# EAGLE design shield (EAGLE 6.4)
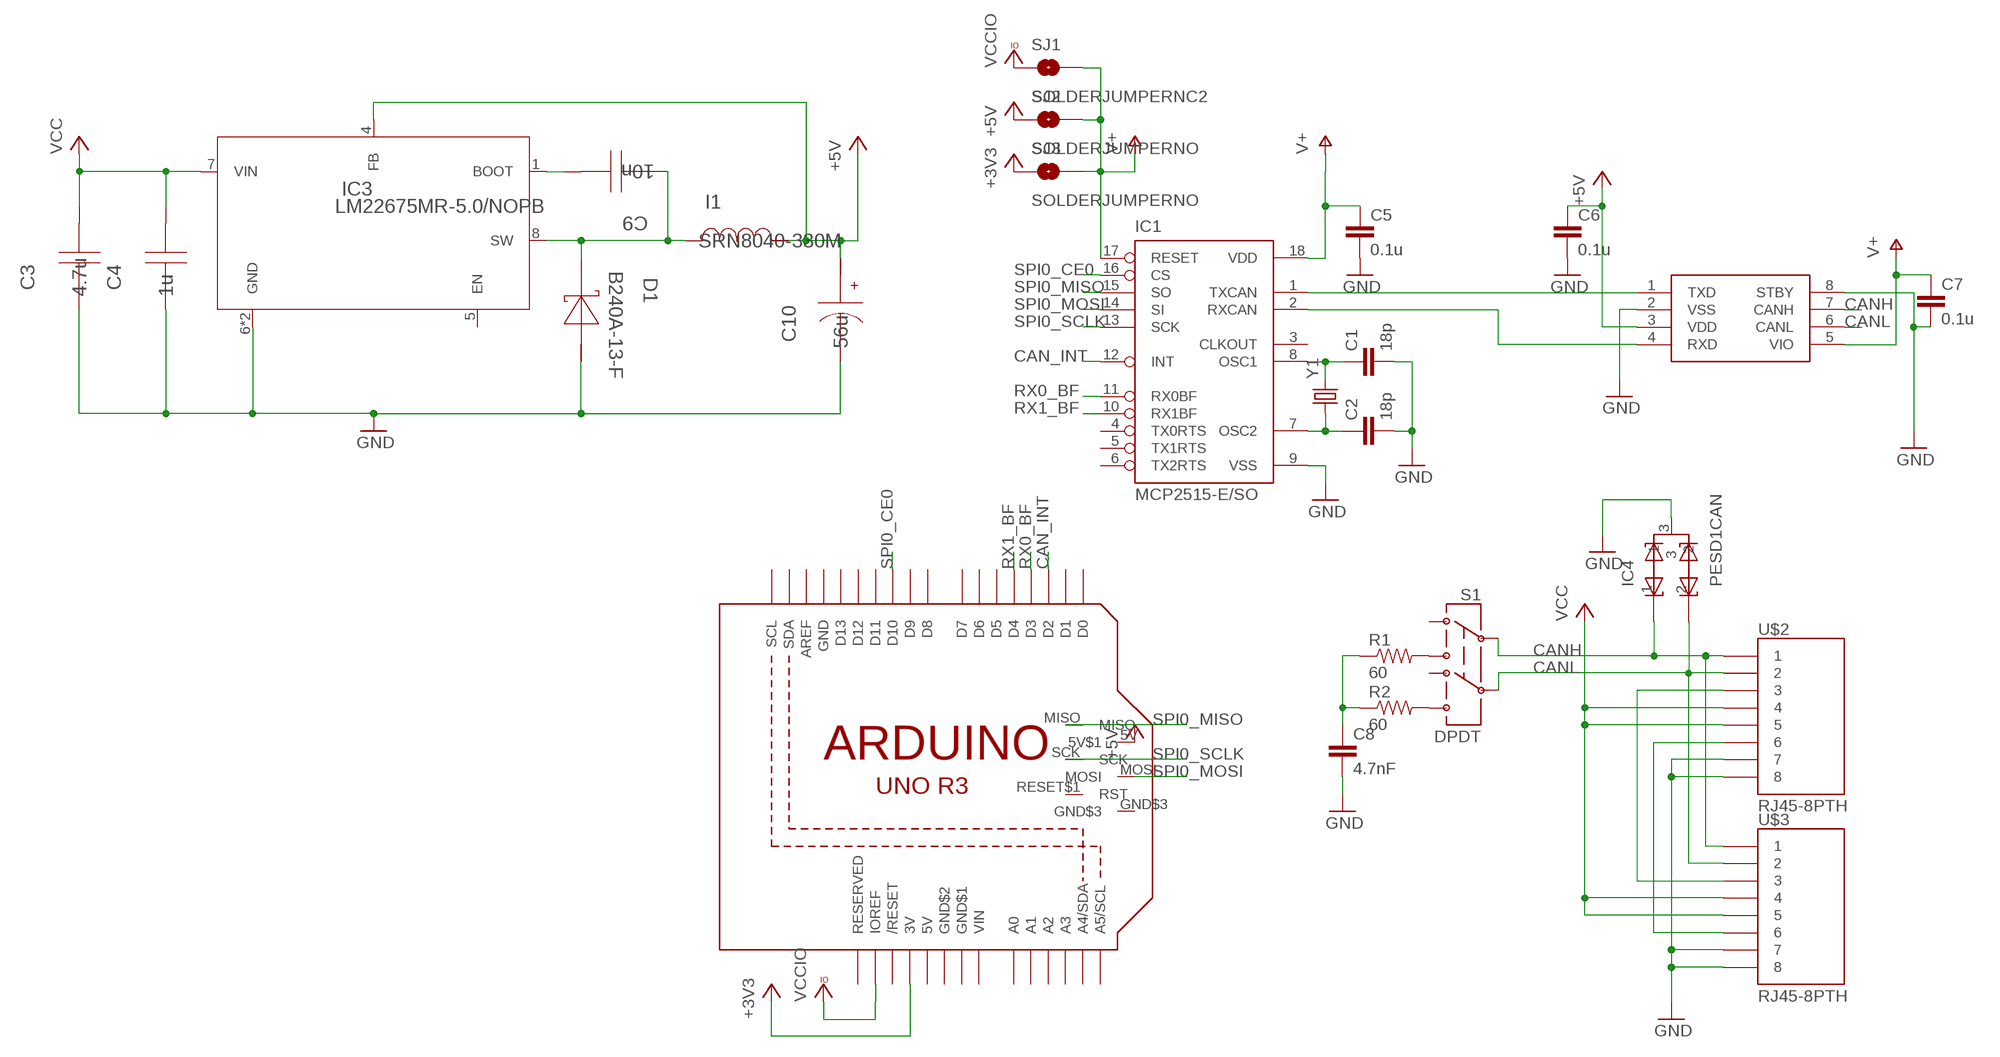
[diagram p0: schematic, sheet 1]

## Parts
C1  18p  CAP0603-CAP  [0603-CAP]
C2  18p  CAP0603-CAP  [0603-CAP]
C3  4.7u  GRM31CR71H475KA12L  [1206]
C4  1u  GMK212B7105KG-T  [0805]
C5  0.1u  CAP0603-CAP  [0603-CAP]
C6  0.1u  CAP0603-CAP  [0603-CAP]
C7  0.1u  CAP0603-CAP  [0603-CAP]
C8  4.7nF  CAP0603-CAP  [0603-CAP]
C9  10n  C0805C103K5RACTU  [0805]
C10  56u  10SVP56M  [SM_RADIAL_6.3AMM]
D1  B240A-13-F  [SMA]
I1  SRN8040-330M  [SRN8040]
IC1  MCP2515-E/SO  [SO18L]
IC2  MCP2562  [SO08]
IC3  LM22675MR-5.0/NOPB  [MRA08B]
IC4  PESD1CAN  [SOT23]
R1  60  RESISTOR0603-RES  [0603-RES]
R2  60  RESISTOR0603-RES  [0603-RES]
S1  DPDT  SWITCH-DPDTAYZ0202  [AYZ0202]
SJ1  SOLDERJUMPERNC2  [SJ_2S-NOTRACE]
SJ2  SOLDERJUMPERNO  [SJ_2S-NO]
SJ3  SOLDERJUMPERNO  [SJ_2S-NO]
U$1  ARDUINO_R3_ICSPNODIM  [ARDUINOR3_ICSP_NODIM]
U$2  RJ45-8PTH  [RJ45-8]
U$3  RJ45-8PTH  [RJ45-8]
Y1  CRYSTAL5X3  [CRYSTAL-SMD-5X3]

## Nets
+3V3: SJ3.1 U$1.3V
+5V: C6.1 C10.1(+) I1.1 IC2.3(VDD) IC3.4(FB) SJ2.1 U$1.5V(5V$1)
CAN_INT: IC1.12(INT) U$1.D2
CANH: IC2.7(CANH) IC4.1 S1.2 U$2.1 U$3.1
CANL: IC2.6(CANL) IC4.2 S1.5 U$2.2 U$3.2
GND: C1.2 C2.2 C3.2 C4.2 C5.2 C6.2 C7.2 C8.2 C10.2(-) D1.2(A) IC1.9(VSS) IC2.2(VSS) IC2.8(STBY) IC3.6(GND) IC3.EPAD(GND) IC4.3 U$2.7 U$2.8 U$3.7 U$3.8
N$2: R1.2 S1.3
N$3: R2.2 S1.6
N$4: C1.1 IC1.8(OSC1) Y1.3
N$5: C2.1 IC1.7(OSC2) Y1.1
N$7: C8.1 R1.1 R2.1
N$8: U$2.6 U$3.6
N$9: U$2.3 U$3.3
N$10: C9.1 IC3.1(BOOT)
RX0_BF: IC1.11(RX0BF) U$1.D3
RX1_BF: IC1.10(RX1BF) U$1.D4
RXCAN: IC1.2(RXCAN) IC2.4(RXD)
SPI0_CE0: IC1.16(CS) U$1.D10
SPI0_MISO: IC1.15(SO) U$1.MISO
SPI0_MOSI: IC1.14(SI) U$1.MOSI
SPI0_SCLK: IC1.13(SCK) U$1.SCK
SWOUT: C9.2 D1.1(K) I1.2 IC3.8(SW)
TXCAN: IC1.1(TXCAN) IC2.1(TXD)
V+: C5.1 C7.1 IC1.17(RESET) IC1.18(VDD) IC2.5(VIO) SJ1.2 SJ2.2 SJ3.2
VCC: C3.1 C4.1 IC3.7(VIN) U$2.4 U$2.5 U$3.4 U$3.5
VCCIO: SJ1.1 U$1.IOREF
Unconnected: IC1.3(CLKOUT) IC1.4(TX0RTS) IC1.5(TX1RTS) IC1.6(TX2RTS) IC3.5(EN) S1.1 S1.4 U$1.A0 U$1.A1 U$1.A2 U$1.A3 U$1.A4(A4/SDA) U$1.A5(A5/SCL) U$1.AREF U$1.D0 U$1.D1 U$1.D5 U$1.D6 U$1.D7 U$1.D8 U$1.D9 U$1.D11 U$1.D12 U$1.D13 U$1.GND$3 U$1.RESERVED U$1.RESET$1(RST) U$1.RESET(/RESET) U$1.SCL U$1.SDA

## Power pins joined to a net without a drawn wire
5V: U$1.+5V(5V)
GND: U$1.GND
GND$1: U$1.GND$1
GND$2: U$1.GND$2
VIN: U$1.VIN

## Library data of the parts
C1 C2 = SparkFun-Capacitors:CAP: Capacitor Standard 0603 ceramic capacitor, and 0.1" leaded capacitor.
C3 = nickparts:GRM31CR71H475KA12L; CAP: 4.7E-6; ESR: 0.0; IRMS: 0.0; MANUFACTURER_NAME: MuRata; MANUFACTURER_PART_NUMBER: GRM31CR71H475KA12L; VDC: 50.0; VENDOR: MuRata
C4 = nickparts:GMK212B7105KG-T; CAP: 1.0E-6; ESR: 0.0; IRMS: 0.0; MANUFACTURER_NAME: Taiyo Yuden; MANUFACTURER_PART_NUMBER: GMK212B7105KG-T; VDC: 35.0; VENDOR: Taiyo Yuden
C5-C8 = SparkFun-Passives:CAP: Capacitor Standard 0603 ceramic capacitor, and 0.1" leaded capacitor.
C9 = nickparts:C0805C103K5RACTU; CAP: 1.0E-8; ESR: 1.739; IRMS: 0.411; MANUFACTURER_NAME: Kemet; MANUFACTURER_PART_NUMBER: C0805C103K5RACTU; VDC: 50.0; VENDOR: Kemet
C10 = nickparts:10SVP56M; CAP: 5.6E-5; ESR: 0.045; IRMS: 1.7; MANUFACTURER_NAME: Sanyo; MANUFACTURER_PART_NUMBER: 10SVP56M; VDC: 10.0; VENDOR: Sanyo
D1 = nickparts:B240A-13-F; DATASHEETURL: http://www.diodes.com/datasheets/ds13004.pdf; IO: 2.0; MANUFACTURER_NAME: Diodes Inc.; MANUFACTURER_PART_NUMBER: B240A-13-F; VENDOR: Diodes Inc.; VFATIO: 0.5; VRRM: 40.0
I1 = nickparts:SRN8040-330M; DATASHEETURL: http://www.bourns.com/data/global/pdfs/SRN8040.pdf; DCR: 0.145; IDC: 1.7; L: 3.3E-5; MANUFACTURER_NAME: Bourns; MANUFACTURER_PART_NUMBER: SRN8040-330M; VENDOR: Bourns
IC1 = mcp2515:MCP2515
IC2 = nickparts:MCP2562: CAN transceiver
IC3 = nickparts:LM22675MR-5.0/NOPB; DATASHEETURL: http://www.ti.com/product/lm22675; FREQUENCY: 500000.0; IMAX: 1.0; MANUFACTURER_NAME: Texas Instruments; MANUFACTURER_PART_NUMBER: LM22675MR-5.0/NOPB; MKTG_PACKAGE: NA; NSID: LM22675MRE-ADJ/NOPB; PACKAGE: NA; VENDOR: Texas Instruments
IC4 = nickparts:PESD1CAN
R1 R2 = SparkFun-Passives:RESISTOR: Resistor Basic schematic elements and footprints for 0603, 1206, and PTH resistors.
S1 = SparkFun-Electromechanical:SWITCH-DPDT: DPDT Version of the COM-00597; PROD_ID: SWCH-08179
SJ1-SJ3 = SparkFun-Passives:SOLDERJUMPER: Solder Jumper Standard SMD solder jumper. Used to automate production. Two varients : Normally Open and Normally Closed are the same, but have different paste layers. NC will have a large amount of paste and should jumper during reflow.
U$1 = nickparts:ARDUINO_R3_ICSP
U$2 U$3 = SparkFun-Connectors:RJ45-8: RJ45 Jack Simple RJ45, 8-pin connection - connector for common Cat5, Cat5e, and Cat6 Ethernet cables. Footprint not yet proven in production. Connector sku is PRT-00643; Breakout PCB sku is BOB-00716.
Y1 = SparkFun-FreqCtrl:CRYSTAL: Various standard crystals. Proven footprints. Spark Fun Electronics SKU : COM-00534

## Board
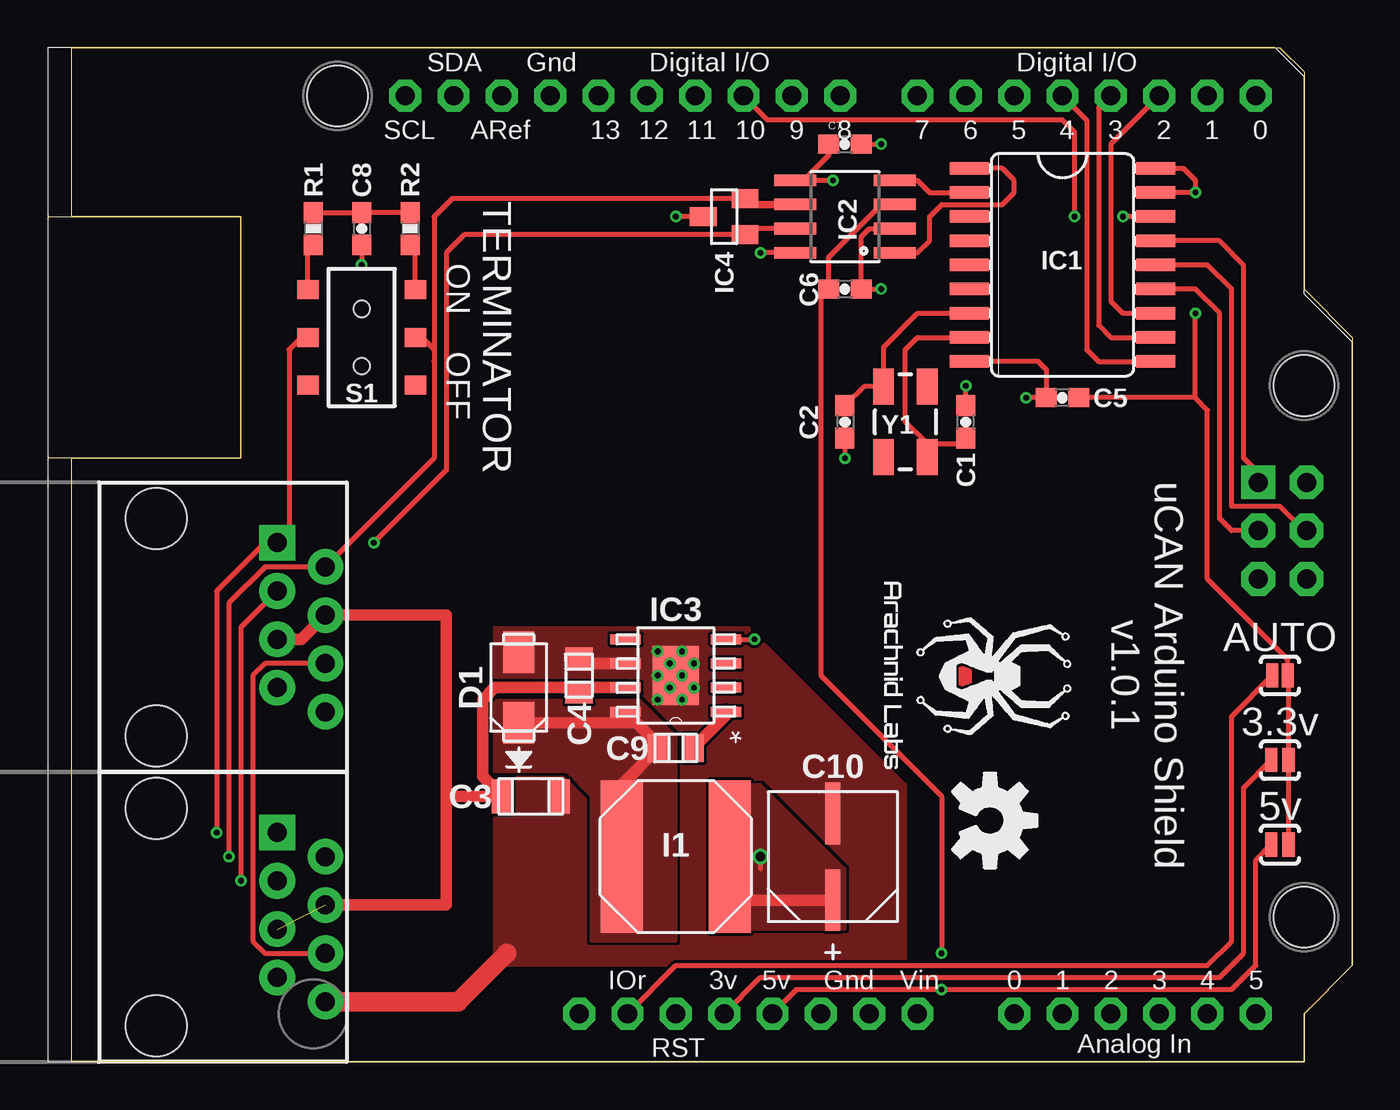
[diagram p1: board, top side]
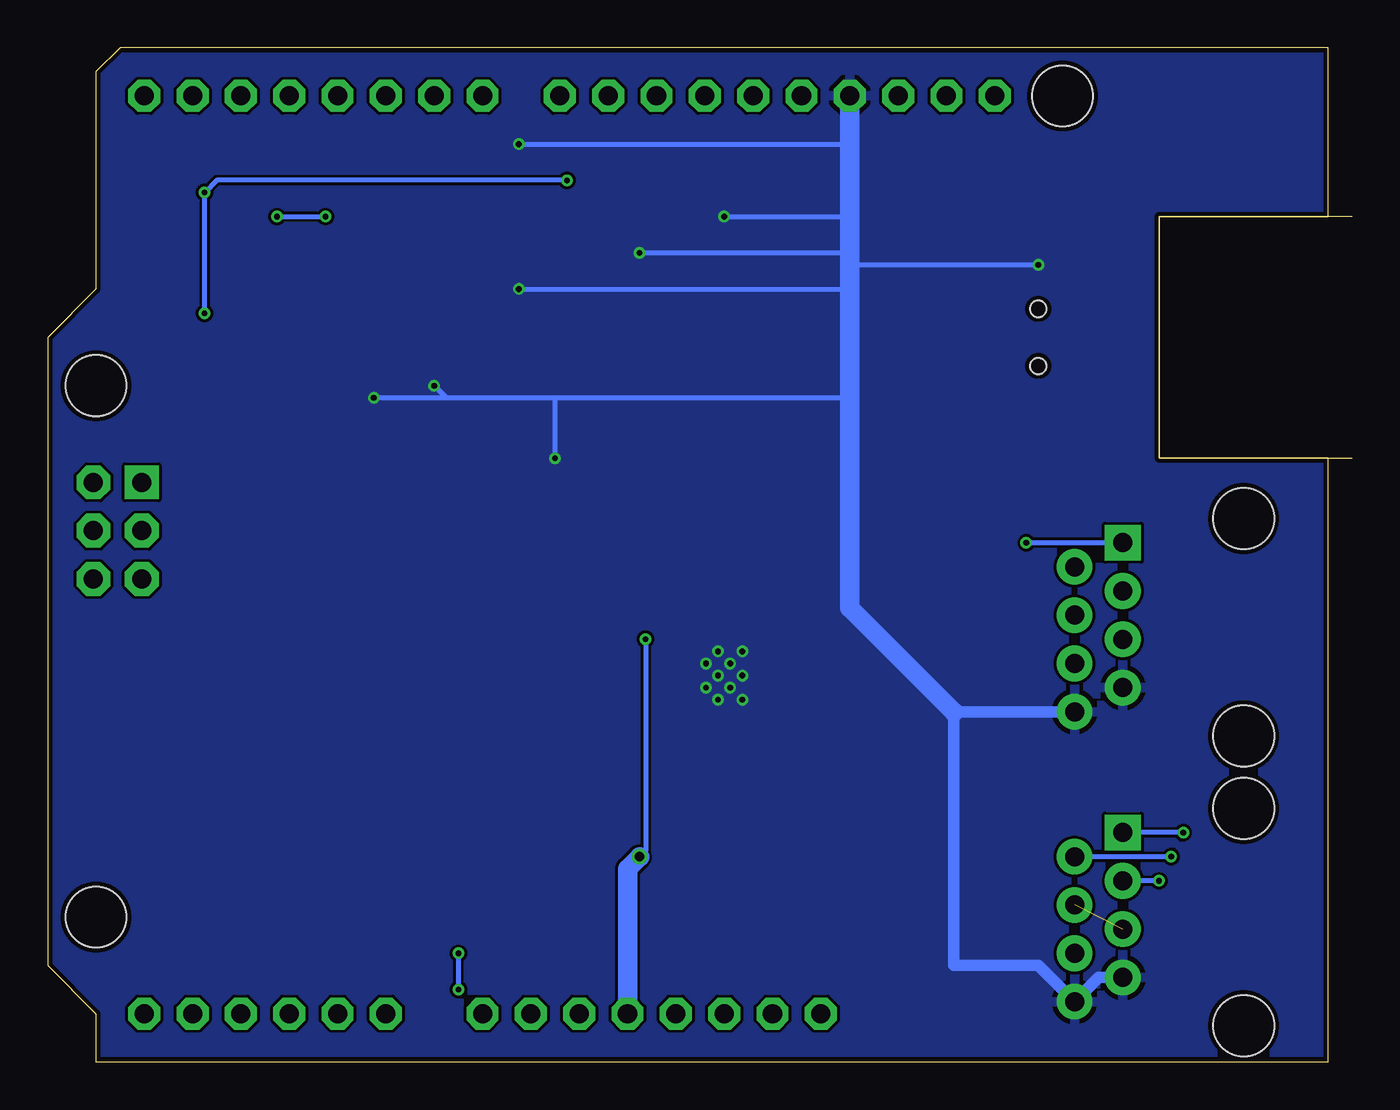
[diagram p2: board, bottom side, seen from below]

Size 68.58 x 53.34 mm. Coordinates in mm from the lower left corner, seen from the top.
Outline: 0,44.45 10.16,44.45
Outline: 10.16,44.45 10.16,31.75
Outline: 10.16,31.75 1.27,31.75
Outline: 1.27,31.75 0,31.75
Outline: 1.27,31.75 1.27,0 66.04,0 66.04,2.54 68.58,5.08 68.58,38.1 66.04,40.64 66.04,52.07 64.77,53.34 1.27,53.34 1.27,44.45 10.16,44.45
Outline: 1.27,31.75 10.16,31.75
Outline: 10.16,31.75 10.16,44.45
Copper layers (1*16): Top 0.035mm / dielectric 1.5mm / Bottom 0.035mm
Design rules "Fusion_eagle_rule_v1.1 *": minimum track width 6mil, minimum drill 0.3mm, track to track 6mil, track to pad 6mil, pad to pad 6mil, via to via 6mil, smd to smd 0mil, copper to edge 10mil, drill to drill 10mil, minimum pad ring 10mil, minimum via ring 6mil, stop-mask expansion 2mil, vias tented up to drill 100mil, thermal gap 10mil
Holes 3.2 mm at 15.24,50.8 66.04,35.56 66.04,7.62

### Footprints (pad centres in the part's own frame; a part is rotated, then mirrored left to right if it is on the bottom)
0603-CAP = smd 1.1 x 1: 1 -0.85,0; 2 0.85,0
1206 = smd 1.118 x 1.803: 1 -1.499,0; 2 1.499,0
0805 = smd 1.118 x 1.448: 1 -0.914,0; 2 0.914,0
SM_RADIAL_6.3AMM = smd 3.251 x 0.787: 1 -2.286,0; 2 2.286,0
SMA = smd 2.184 x 1.626: 1 -1.854,0; 2 1.854,0
SRN8040 = smd 2.21 x 8.001: 1 -2.845,0; 2 2.845,0
SO18L = smd 0.66 x 2.032: 1 -5.08,-4.902; 2 -3.81,-4.902; 3 -2.54,-4.902; 4 -1.27,-4.902; 5 0,-4.902; 6 1.27,-4.902; 7 2.54,-4.902; 8 3.81,-4.902; 9 5.08,-4.902; 10 5.08,4.902; 11 3.81,4.902; 12 2.54,4.902; 13 1.27,4.902; 14 0,4.902; 15 -1.27,4.902; 16 -2.54,4.902; 17 -3.81,4.902; 18 -5.08,4.902
SO08 = smd 0.61 x 2.21: 1 -1.905,-2.616; 2 -0.635,-2.616; 3 0.635,-2.616; 4 1.905,-2.616; 5 1.905,2.616; 6 0.635,2.616; 7 -0.635,2.616; 8 -1.905,2.616
MRA08B = smd 1.6 x 0.533: 1 -2.642,1.905; 2 -2.642,0.635; 3 -2.642,-0.635; 4 -2.642,-1.905; 5 2.642,-1.905; 6 2.642,-0.635; 7 2.642,0.635; 8 2.642,1.905 | smd 2.413 x 3.099: EPAD 0,0
SOT23 = smd 1 x 1.4: 1 -0.95,-1.1; 2 0.95,-1.1; 3 0,1.1
0603-RES = smd 1.1 x 1: 1 -0.85,0; 2 0.85,0
AYZ0202 = smd 1 x 1.15: 1 -2.5,2.825; 2 0,2.825; 3 2.5,2.825; 4 -2.5,-2.825; 5 0,-2.825; 6 2.5,-2.825 | hole 0.85: 1.5,0; -1.5,0
SJ_2S-NOTRACE = smd 0.635 x 1.27: 1 -0.401,0; 2 0.413,0
SJ_2S-NO = smd 0.635 x 1.27: 1 -0.45,0; 2 0.45,0
ARDUINOR3_ICSP_NODIM = drill 1 pad 1.676 octagon: 3V 35.56,2.54; 5V 38.1,2.54; A0 50.8,2.54; A1 53.34,2.54; A2 55.88,2.54; A3 58.42,2.54; A4 60.96,2.54; A5 63.5,2.54; AREF 23.876,50.8; D0 63.5,50.8; D1 60.96,50.8; D2 58.42,50.8; D3 55.88,50.8; D4 53.34,50.8; D5 50.8,50.8; D6 48.26,50.8; D7 45.72,50.8; D8 41.656,50.8; D9 39.116,50.8; D10 36.576,50.8; D11 34.036,50.8; D12 31.496,50.8; D13 28.956,50.8; GND 26.416,50.8; GND$2 43.18,2.54; GND$3 40.64,2.54; IOREF 30.48,2.54; RESERVED 27.94,2.54; RESET 33.02,2.54; SCL 18.796,50.8; SDA 21.336,50.8; VIN 45.72,2.54 | drill 1 pad 1.778 octagon: +5V 66.167,30.48; GND$1 66.167,25.4; MOSI 66.167,27.94; RESET$1 63.627,25.4; SCK 63.627,27.94 | drill 1 pad 1.778 square: MISO 63.627,30.48
RJ45-8 = drill 1 pad 1.88 square: 1 -4.445,6.35 | drill 1 pad 1.88: 2 -3.175,8.89; 3 -1.905,6.35; 4 -0.635,8.89; 5 0.635,6.35; 6 1.905,8.89; 7 3.175,6.35; 8 4.445,8.89 | hole 3.2: -5.715,0; 5.715,0
CRYSTAL-SMD-5X3 = smd 1.9 x 1.1: 1 -1.85,-1.15; 2 1.85,-1.15; 3 1.85,1.15; 4 -1.85,1.15

### Placement (x,y rotation side)
C1  48.26,33.66 90 top
C2  41.91,33.66 270 top
C3  25.4,13.97 0 top
C4  27.94,20.32 90 top
C5  53.34,34.92 180 top
C6  41.91,40.64 0 top
C7  41.91,48.26 0 top
C8  16.51,43.81 270 top
C9  33.02,16.51 180 top
C10  41.27,10.79 90 top
D1  24.77,19.68 90 top
I1  33.02,10.79 180 top
IC1  53.34,41.91 270 top
IC2  41.91,44.45 90 top
IC3  33.02,20.32 180 top
IC4  35.56,44.45 90 top
R1  13.97,43.81 270 top
R2  19.05,43.81 270 top
S1  16.51,38.1 90 top
SJ1  64.77,20.32 0 top
SJ2  64.77,11.43 0 top
SJ3  64.77,15.88 0 top
U$1  0,0 0 top
U$2  5.71,22.86 270 top
U$3  5.71,7.62 270 top
U$4  [ARACHNID_LABS_LOGO_SM]  48.9,20.32 270 top
U$5  [OSHW-LOGO-M]  49.53,12.7 270 top
Y1  45.09,33.66 270 top

### Tracks (layer width: path | path; a pad name or v marks a point on that pad's centre or on a via)
+3V3
  Top 0.254: U$1.3V 37.47,4.45 61.59,4.45 62.87,5.71 62.87,14.42 SJ3.1
+5V  (via drill 0.3, 0.5)
  Top 0.254: IC2.3 43.81,45.09 41.06,42.33 C6.1 40.64,40.64 40.64,20.32 46.99,13.97 v46.99,5.71 | 45.09,3.81 39.37,3.81 U$1.5V | 45.09,3.81 v46.99,3.81 | v46.99,3.81 62.23,3.81 63.5,5.08 63.5,10.61 SJ2.1 | IC3.4 v37.15,22.23 | v37.47,10.79 37.47,10.16 | v46.99,3.81 45.09,3.81
  Top 0.61: C10.1 35.94,8.51 35.56,8.89 35.56,10.49 I1.1
  Bottom 0.254: v37.15,22.23 37.15,11.11 v37.47,10.79 | v46.99,5.71 v46.99,3.81
  Bottom 1.016: U$1.5V 38.1,10.16 v37.47,10.79
  pour Top (no thermals): 34.92,6.99 34.92,14.61 37.47,14.61 41.91,10.16 41.91,6.99
CAN_INT
  Top 0.254: U$1.D2 55.88,48.26 55.88,40.01 56.52,39.37 IC1.12
CANH  (via drill 0.3)
  Top 0.254: S1.2 13.34,38.1 12.7,37.47 12.7,27.94 U$2.1 11.43,27.3 8.89,24.77 v8.89,12.06 | IC2.7 36.98,43.81 IC4.1 21.91,43.5 20.95,42.55 20.95,31.11 v17.14,27.3
  Bottom 0.254: v17.14,27.3 U$2.1 | v8.89,12.06 U$3.1
CANL  (via drill 0.3)
  Top 0.254: S1.5 19.68,38.1 20.32,37.47 20.32,36.83 | 20.32,36.83 20.32,31.75 U$2.2 11.43,26.04 9.53,24.13 v9.53,10.79 | IC4.2 21.27,45.4 20.32,44.45 20.32,36.83
  Top 0.406: IC4.2 36.66,45.09 IC2.6
  Bottom 0.254: v9.53,10.79 U$3.2
GND  (via drill 0.3)
  Top 0.254: IC2.2 43.18,43.81 42.76,43.4 C6.2 v43.81,40.64 | IC1.9 52.07,36.83 52.49,36.41 C5.2 v51.44,34.92 | C8.2 v16.51,41.91 | IC4.3 v33.02,44.45 | IC2.8 v37.47,42.55 | C1.2 v48.26,35.56 | C2.2 v41.91,31.75 | C7.2 v43.81,48.26
  Top 0.61: IC3.6 28.22,20.95 C4.2
  Top 1.016: U$3.8 21.59,3.17 24.13,5.71
  Bottom 0.254: v16.51,41.91 26.42,41.91 | v33.02,44.45 26.42,44.45 | v37.47,42.55 26.42,42.55 | v43.81,40.64 26.42,40.64 | v51.44,34.92 47.62,34.92 | 47.62,34.92 41.91,34.92 | 41.91,34.92 26.42,34.92 | v48.26,35.56 47.62,34.92 | v41.91,31.75 41.91,34.92 | v43.81,48.26 26.42,48.26
  Bottom 0.61: U$2.8 20.95,18.41 20.95,5.71 20.95,5.08 16.51,5.08 U$3.8 13.34,4.45 U$3.7
  Bottom 1.016: U$1.GND 26.42,48.26 26.42,44.45 26.42,42.55 26.42,41.91 26.42,40.64 26.42,34.92 26.42,23.88 20.95,18.41
  other vias: 32.07,21.59 33.34,21.59 32.7,20.95 33.97,20.95 33.34,20.32 32.07,20.32 32.7,19.68 33.97,19.68 33.34,19.05 32.07,19.05
  pour Bottom: 0,0 0,53.34 68.58,53.34 68.58,0
  pour Top (rank 2, no thermals): 23.5,5.08 23.5,22.86 36.83,22.86 45.09,14.61 45.09,5.08
N$2
  Top 0.254: S1.3 13.69,42.68 R1.2
N$3
  Top 0.254: S1.6 19.34,42.68 R2.2
N$4
  Top 0.254: Y1.3 46.23,32.51 | 46.23,32.51 45.09,33.66 45.09,37.47 45.72,38.1 IC1.8 | 46.23,32.51 47.96,32.51 C1.1
N$5
  Top 0.254: C2.1 42.91,35.51 Y1.1 43.94,37.59 45.72,39.37 IC1.7
N$7
  Top 0.254: R1.1 C8.1 R2.1
N$8
  Top 0.254: U$2.6 11.43,20.95 10.79,20.32 10.79,6.35 11.43,5.71 U$3.6
N$9  (via drill 0.3)
  Top 0.254: U$2.3 10.16,22.86 v10.16,9.53
  Bottom 0.254: v10.16,9.53 U$3.3
N$10
  Top 0.61: IC3.1 35.66,18.24 C9.1
RX0_BF
  Top 0.254: U$1.D3 55.24,50.16 55.24,38.73 55.88,38.1 IC1.11
RX1_BF
  Top 0.254: U$1.D4 54.61,49.53 54.61,37.47 55.24,36.83 IC1.10
RXCAN
  Top 0.254: IC1.2 48.26,45.72 IC1.2 | IC2.4 45.72,46.35 46.35,45.72 IC1.2
SPI0_CE0  (via drill 0.3)
  Top 0.254: IC1.16 v56.52,44.45 | v53.98,44.45 53.98,48.9 53.34,49.53 37.85,49.53 U$1.D10
  Bottom 0.254: v56.52,44.45 v53.98,44.45
SPI0_MISO
  Top 0.254: U$1.MISO 63.63,30.99 62.87,31.75 62.87,41.91 61.59,43.18 IC1.15
SPI0_MOSI
  Top 0.254: U$1.MOSI 66.04,27.94 64.77,29.21 62.23,29.21 62.23,40.64 60.96,41.91 IC1.14
SPI0_SCLK
  Top 0.254: U$1.SCK 62.23,27.94 61.59,28.57 61.59,39.37 60.33,40.64 IC1.13
SWOUT
  Top 0.61: I1.2 30.18,14.58 C9.2 32.11,16.69 31.38,17.41 | 31.38,17.41 IC3.8 | D1.1 30.96,17.83 31.38,17.41
  pour Top (no thermals): 23.5,19.05 31.11,19.05 33.02,17.14 33.02,6.99 33.02,6.35 28.57,6.35 28.57,13.97 27.3,15.24 23.5,15.24
TXCAN
  Top 0.254: IC2.1 45.72,42.55 46.35,43.18 46.35,44.45 46.99,45.09 50.16,45.09 50.8,45.72 50.8,46.35 50.16,46.99 IC1.1
V+  (via drill 0.3)
  Top 0.254: SJ3.2 SJ2.2 65.22,20.28 SJ1.2 65.18,21.18 60.96,25.4 60.96,34.29 60.33,34.92 | IC2.5 39.29,46.49 39.87,46.49 | 60.33,34.92 C5.1 | 60.33,34.92 v60.33,39.37 | IC1.17 v60.33,45.72 60.33,46.35 59.69,46.99 IC1.18 | 39.87,46.49 40.01,46.35 v41.27,46.35 | C7.1 41.06,47.69 39.87,46.49
  Bottom 0.254: v60.33,39.37 v60.33,45.72 59.69,46.35 v41.27,46.35
VCC  (1 unrouted)
  Top 0.61: 20.95,13.97 20.95,23.5 U$2.4 13.34,22.23 U$2.5 | 20.95,13.97 20.95,8.26 | 20.95,8.26 U$3.4 | IC3.7 28.22,19.68 C4.1 27.94,19.68 23.5,19.68 22.86,19.05 22.86,15.01 C3.1 20.95,13.97 | 20.95,8.26 20.95,13.97
VCCIO
  Top 0.254: U$1.IOREF 33.02,5.08 60.96,5.08 62.23,6.35 62.23,18.18 SJ1.1

### Text on the board
tNames: ON | TERMINATOR | OFF | AUTO | uCAN Arduino Shield / v1.0.1 | 3.3v | 5v